# EAGLE schematic wiring (EAGLE 9.5.1)
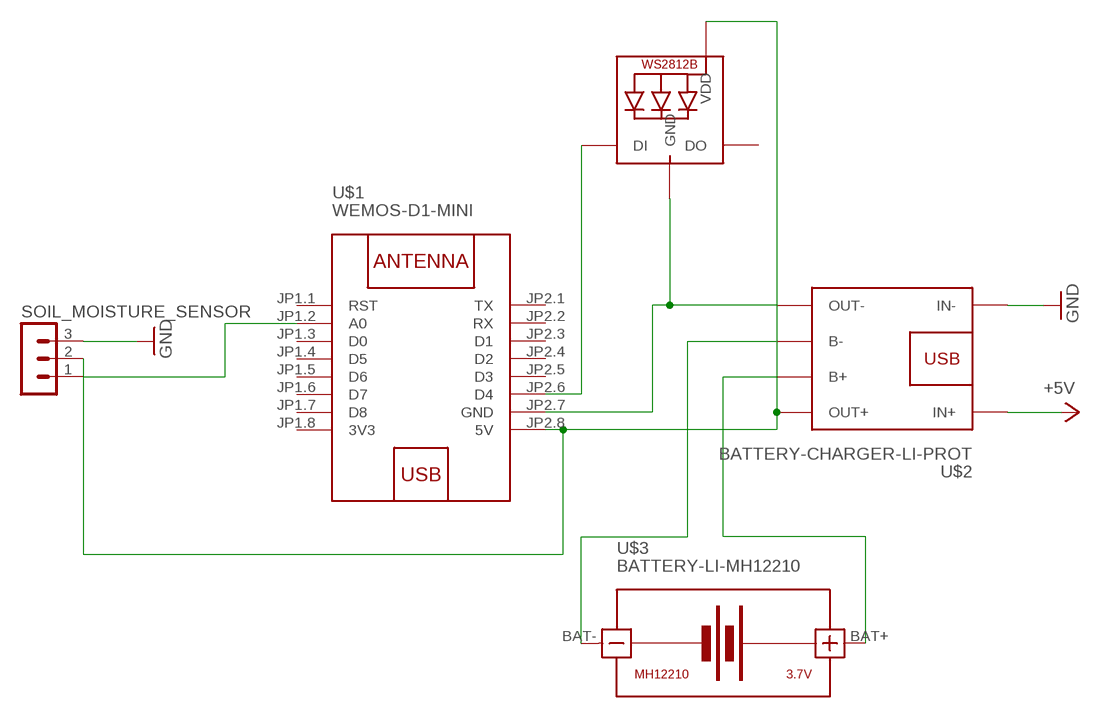
[diagram p0: schematic, sheet 1]

## Parts
LED1  WS2812B3535  [LED3535]
SOIL_MOISTURE_SENSOR  MA03-1  [MA03-1]
U$1  WEMOS-D1-MINI  [WEMOS-D1-MINI]
U$2  BATTERY-CHARGER-LI-PROT  [BATTERY-CHARGER-LI-PROT]
U$3  BATTERY-LI-MH12210  [BATTERY-LI-MH12210]

## Nets
+5V: U$2.IN+
GND: SOIL_MOISTURE_SENSOR.3 U$2.IN-
N$2: U$2.B+ U$3.BAT+
N$3: U$2.B- U$3.BAT-
N$4: LED1.2(VDD) SOIL_MOISTURE_SENSOR.2 U$1.JP2.8(5V) U$2.OUT+
N$5: LED1.4(GND) U$1.JP2.7(GND) U$2.OUT-
N$6: SOIL_MOISTURE_SENSOR.1 U$1.JP1.2(A0)
N$8: LED1.1(DI) U$1.JP2.6(D4)
Unconnected: LED1.3(DO) U$1.JP1.1(RST) U$1.JP1.3(D0) U$1.JP1.4(D5) U$1.JP1.5(D6) U$1.JP1.6(D7) U$1.JP1.7(D8) U$1.JP2.1(TX) U$1.JP2.2(RX) U$1.JP2.3(D1) U$1.JP2.4(D2) U$1.JP2.5(D3)

## Power pins joined to a net without a drawn wire
3V3: U$1.JP1.8(3V3)

## Library data of the parts
LED1 = WS2812B:WS2812B
SOIL_MOISTURE_SENSOR = con-lstb:MA03-1: PIN HEADER; OC_FARNELL: unknown; OC_NEWARK: unknown
U$1 = diy-modules:WEMOS-D1-MINI: WEMOS D1 mini: Mini Wi-Fi Board based on ESP-8266 device More details can be found here: https://www.wemos.cc/product/d1-mini.html Click here to find device on ebay.com <http://www.ebay.com/sch/wemos+d1+mini+nodemcu>
U$2 = diy-modules:BATTERY-CHARGER-LI-PROT: Lithium Battery 5V Charger with protection circuit More details available here: http://www.instructables.com/id/DIY-Lithium-ion-Battery-Charger/step4/TP4056-based-lithium-ion-battery-charger-module/ Click here to find device on ebay.com <http://www.ebay.com/sch/tp4056+charger+usb+protection>
U$3 = diy-modules:BATTERY-LI-MH12210: Lithium-Ion MH12210 Rechargeable Battery Panasonic NCR18650PF battery datasheet available here: https://industrial.panasonic.com/cdbs/www-data/pdf2/ACI4000/ACI4000C12.pdf Click here to find device on ebay.com <http://www.ebay.com/sch/ncr18650b+battery>